# EAGLE design Flipdot (EAGLE 6.4)
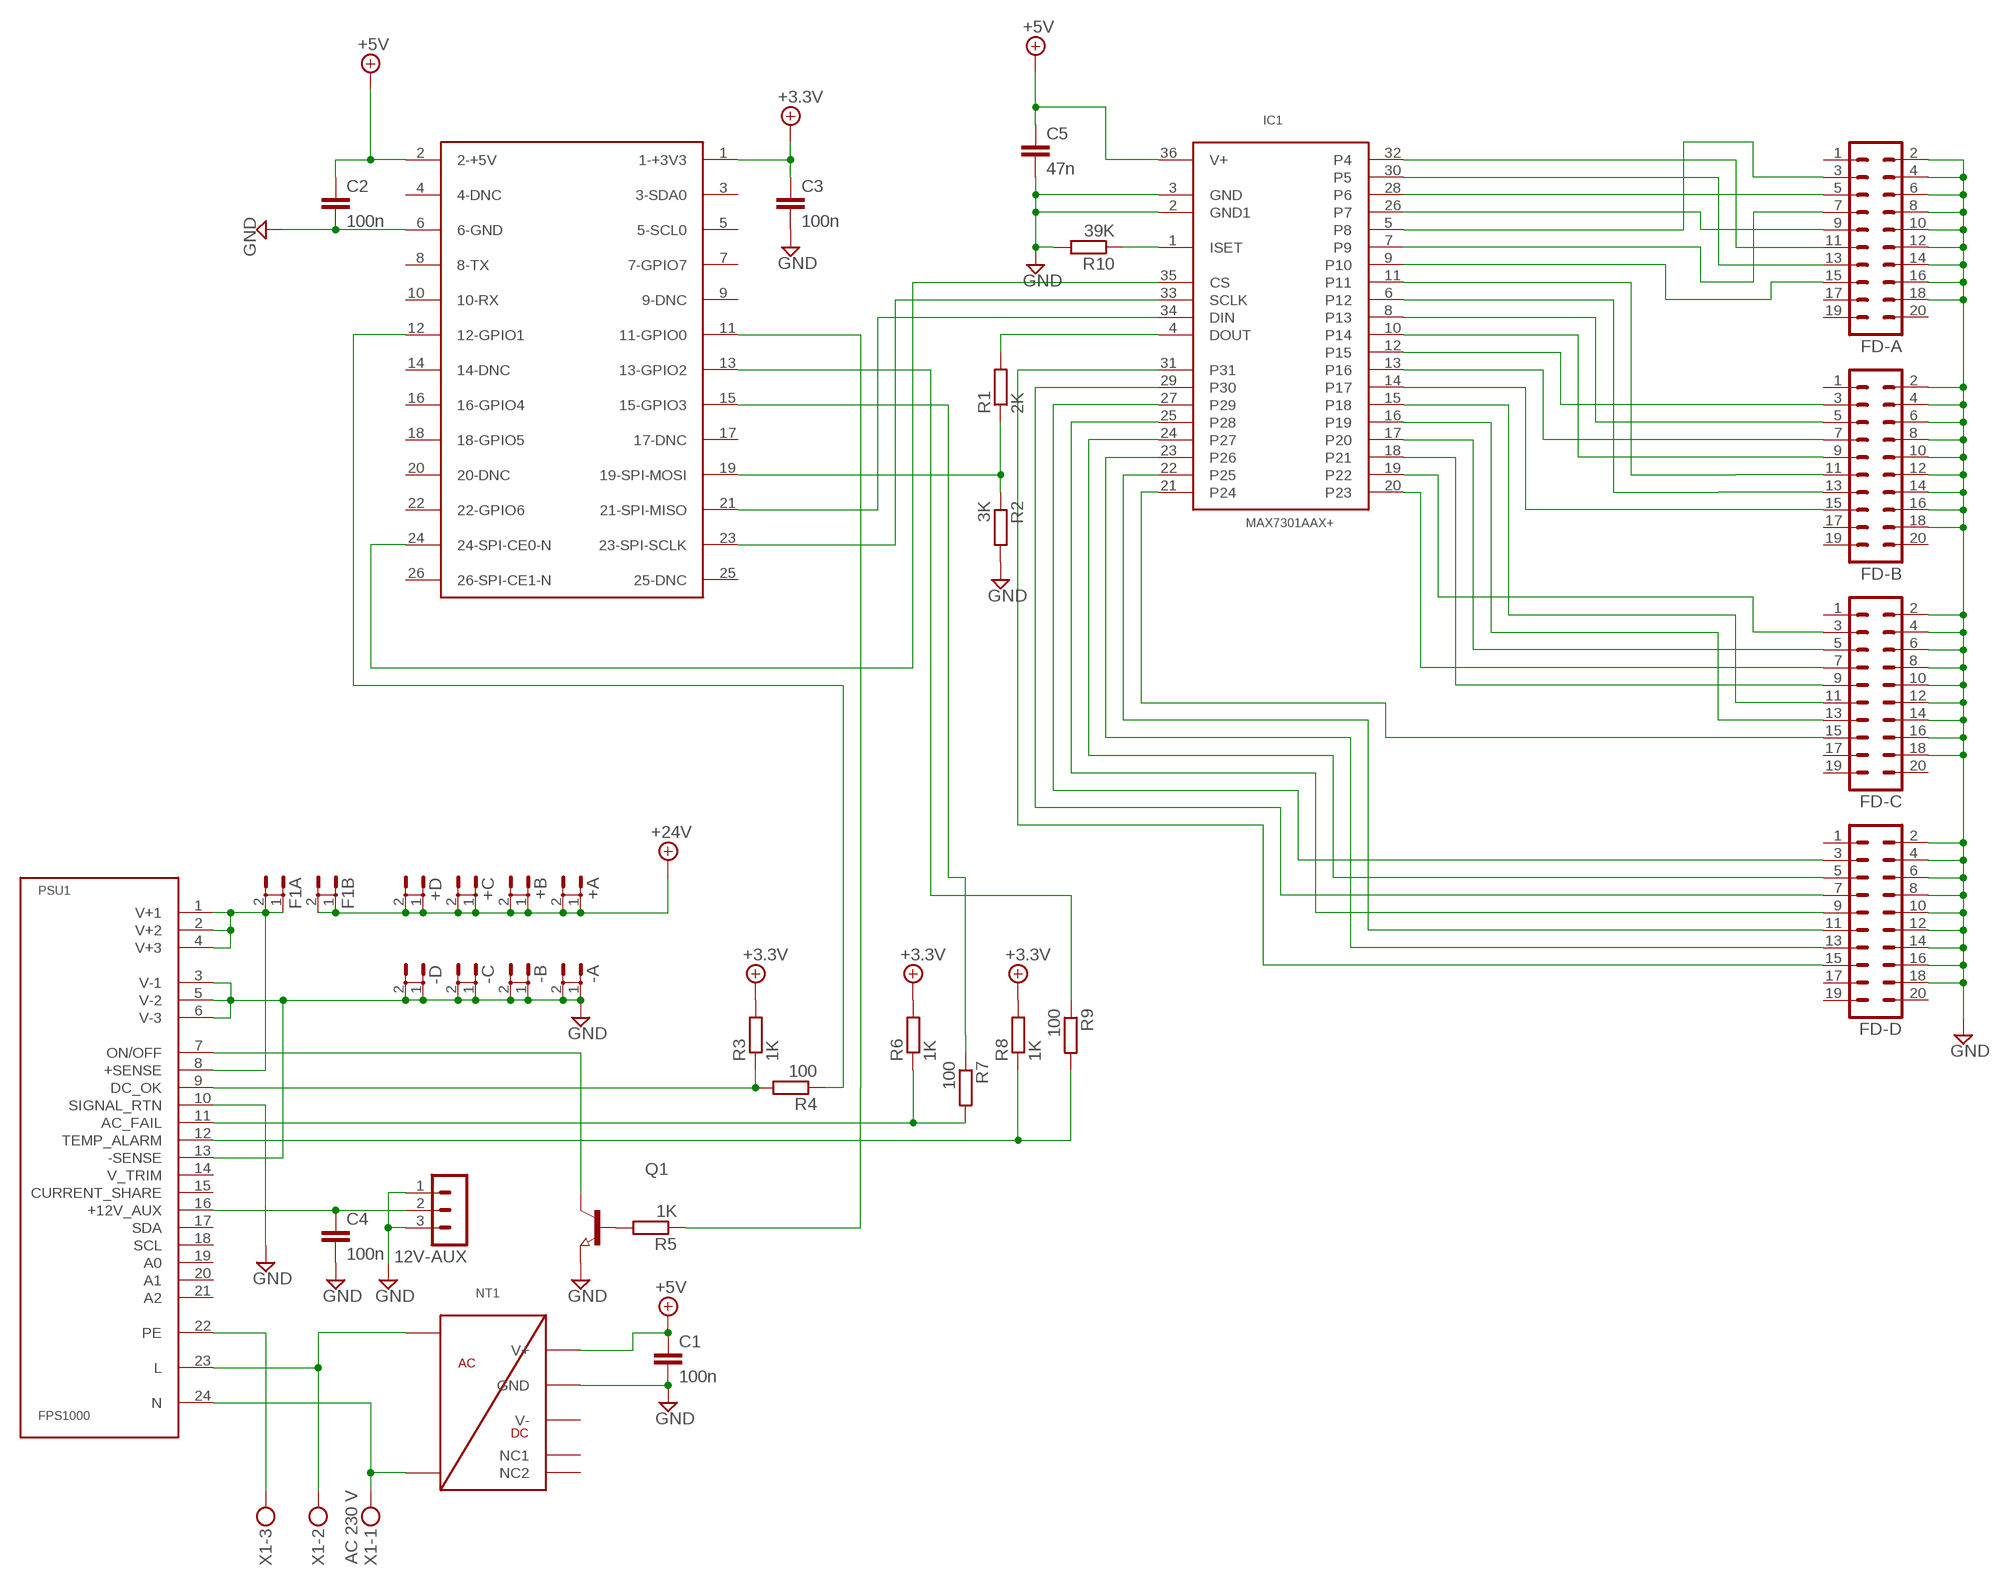
[diagram p0: schematic, sheet 1]

## Parts
12V-AUX  MA03-1  [MA03-1]
+A  ST6,3  [ST6,3]
+B  ST6,3  [ST6,3]
+C  ST6,3  [ST6,3]
+D  ST6,3  [ST6,3]
-A  ST6,3  [ST6,3]
-B  ST6,3  [ST6,3]
-C  ST6,3  [ST6,3]
-D  ST6,3  [ST6,3]
C1  100n  C-EUC0603  [C0603]
C2  100n  C-EUC0603  [C0603]
C3  100n  C-EUC0603  [C0603]
C4  100n  C-EUC0603  [C0603]
C5  47n  C-EUC0603  [C0603]
F1A  ST6,3  [ST6,3]
F1B  ST6,3  [ST6,3]
FD-A  MA10-2  [MA10-2]
FD-B  MA10-2  [MA10-2]
FD-C  MA10-2  [MA10-2]
FD-D  MA10-2  [MA10-2]
IC1  MAX7301AAX+  [SSOP36]
NT1  TMPM04  [TPM04]
PSU1  FPS1000  [24W9F]
Q1  NPN-TRANSISTOR_SOT23  [SOT23]
R1  2K  R-EU_R0603  [R0603]
R2  3K  R-EU_R0603  [R0603]
R3  1K  R-EU_R0603  [R0603]
R4  100  R-EU_R0603  [R0603]
R5  1K  R-EU_R0603  [R0603]
R6  1K  R-EU_R0603  [R0603]
R7  100  R-EU_R0603  [R0603]
R8  1K  R-EU_R0603  [R0603]
R9  100  R-EU_R0603  [R0603]
R10  39K  R-EU_R0603  [R0603]
U$1  RASPBERRY-PI  [RASPBERRY-PI]
X1  AC 230 V  MKDSN1,5/3-5,08  [MKDSN1,5/3-5,08]

## Nets
+3.3V: C3.1 R3.2 R6.2 R8.2 U$1.1(1-+3V3)
+5V: C1.1 C2.1 C5.1 IC1.36(V+) NT1.3(V+) U$1.2(2-+5V)
+24V: +A.1 +A.2 +B.1 +B.2 +C.1 +C.2 +D.1 +D.2 F1B.1 F1B.2
GND: 12V-AUX.1 12V-AUX.3 -A.1 -A.2 -B.1 -B.2 -C.1 -C.2 -D.1 -D.2 C1.2 C2.2 C3.2 C4.2 C5.2 FD-A.2 FD-A.4 FD-A.6 FD-A.8 FD-A.10 FD-A.12 FD-A.14 FD-A.16 FD-A.18 FD-B.2 FD-B.4 FD-B.6 FD-B.8 FD-B.10 FD-B.12 FD-B.14 FD-B.16 FD-B.18 FD-C.2 FD-C.4 FD-C.6 FD-C.8 FD-C.10 FD-C.12 FD-C.14 FD-C.16 FD-C.18 FD-D.2 FD-D.4 FD-D.6 FD-D.8 FD-D.10 FD-D.12 FD-D.14 FD-D.16 FD-D.18 IC1.2(GND1) IC1.3(GND) NT1.4(GND) PSU1.3(V-1) PSU1.5(V-2) PSU1.6(V-3) PSU1.10(SIGNAL_RTN) PSU1.13(-SENSE) Q1.2(E) R2.2 R10.2 U$1.6(6-GND)
N$1: FD-D.11 IC1.22(P25)
N$2: FD-D.13 IC1.23(P26)
N$3: FD-A.5 IC1.28(P6)
N$4: FD-A.9 IC1.26(P7)
N$5: FD-A.3 IC1.5(P8)
N$6: FD-A.7 IC1.7(P9)
N$7: FD-A.15 IC1.9(P10)
N$8: FD-B.5 IC1.8(P13)
N$9: FD-B.9 IC1.10(P14)
N$10: FD-B.3 IC1.12(P15)
N$11: FD-B.7 IC1.13(P16)
N$12: FD-B.15 IC1.14(P17)
N$13: FD-C.5 IC1.17(P20)
N$14: FD-C.9 IC1.18(P21)
N$15: FD-C.3 IC1.19(P22)
N$16: FD-C.7 IC1.20(P23)
N$17: FD-C.15 IC1.21(P24)
N$18: FD-D.5 IC1.24(P27)
N$19: FD-D.9 IC1.25(P28)
N$20: FD-D.3 IC1.27(P29)
N$21: FD-D.7 IC1.29(P30)
N$22: FD-D.15 IC1.31
N$23: IC1.33(SCLK) U$1.23(23-SPI-SCLK)
N$24: IC1.35(CS) U$1.24(24-SPI-CE0-N)
N$25: IC1.34(DIN) U$1.21(21-SPI-MISO)
N$26: F1A.1 F1A.2 PSU1.1(V+1) PSU1.2(V+2) PSU1.4(V+3) PSU1.8(+SENSE)
N$27: Q1.1(B) R5.2
N$28: PSU1.7(ON/OFF) Q1.3(C)
N$29: PSU1.9(DC_OK) R3.1 R4.2
N$30: R5.1 U$1.11(11-GPIO0)
N$31: R4.1 U$1.12(12-GPIO1)
N$32: PSU1.11(AC_FAIL) R6.1 R7.2
N$33: R9.1 U$1.13(13-GPIO2)
N$34: PSU1.12(TEMP_ALARM) R8.1 R9.2
N$35: R7.1 U$1.15(15-GPIO3)
N$36: PSU1.22(PE) X1.3
N$37: FD-B.13 IC1.6(P12)
N$38: IC1.4(DOUT) R1.2
N$39: R1.1 R2.1 U$1.19(19-SPI-MOSI)
N$40: FD-B.11 IC1.11
N$41: FD-C.11 IC1.15(P18)
N$42: FD-A.11 IC1.32(P4)
N$43: FD-C.13 IC1.16(P19)
N$45: FD-A.13 IC1.30(P5)
N$46: NT1.6(N) PSU1.24(N) X1.1
N$47: NT1.7(L) PSU1.23(L) X1.2
N$48: IC1.1(ISET) R10.1
N$50: 12V-AUX.2 C4.1 PSU1.16(+12V_AUX)
Unconnected: FD-A.1 FD-A.17 FD-A.19 FD-A.20 FD-B.1 FD-B.17 FD-B.19 FD-B.20 FD-C.1 FD-C.17 FD-C.19 FD-C.20 FD-D.1 FD-D.17 FD-D.19 FD-D.20 PSU1.14(V_TRIM) PSU1.15(CURRENT_SHARE) PSU1.17(SDA) PSU1.18(SCL) PSU1.19(A0) PSU1.20(A1) PSU1.21(A2) U$1.3(3-SDA0) U$1.4(4-DNC) U$1.5(5-SCL0) U$1.7(7-GPIO7) U$1.8(8-TX) U$1.9(9-DNC) U$1.10(10-RX) U$1.14(14-DNC) U$1.16(16-GPIO4) U$1.17(17-DNC) U$1.18(18-GPIO5) U$1.20(20-DNC) U$1.22(22-GPIO6) U$1.25(25-DNC) U$1.26(26-SPI-CE1-N)

## Power pins joined to a net without a drawn wire
NC1: NT1.1(NC1)
NC2: NT1.2(NC2)
V-: NT1.5(V-)

## Library data of the parts
12V-AUX = con-lstb:MA03-1: PIN HEADER; OC_FARNELL: unknown; OC_NEWARK: unknown
+A +B +C +D -A -B -C -D F1A F1B = con-rib:ST6,3: RIBBON CABLE CONNECTOR Flachstecker / Faston; OC_FARNELL: unknown; OC_NEWARK: unknown
C1-C5 = rcl:C-EU: CAPACITOR, European symbol
FD-A FD-B FD-C FD-D = con-lstb:MA10-2: PIN HEADER; OC_FARNELL: unknown; OC_NEWARK: unknown
IC1 = maxim:MAX7301AAX+: Maxim 28 Port SPI 28 MHz I/O Expander 2.5 - 5.5 V
NT1 = Ice:TMPM04: Traco Power TMPM 04 Schaltnetzteil 4W
PSU1 = positronic:FPS1000: TDK Lamda FPS1000 with Positronic PCIB24W9F400A1 Connector
Q1 = semicon-smd-ipc:NPN-TRANSISTOR_: NPN TRANSISTOR
R1-R10 = rcl:R-EU_: RESISTOR, European symbol
U$1 = RaspberryPi:RASPBERRY-PI: Raspberry Pi Board <http://www.raspberrypi.org/> Jacques Lagnel V1.0 (beta) 2012 Board dimension: Forum 3D model <http://www.raspberrypi.org/forum/general-discussion/mechanical-profile-3d-models?value=3d%20model&type=1&include=1&search=1&ret=all> The GPIO Connector (P1): http://elinux.org/RPi_Low-level_peripherals
X1 = con-phoenix-508:MKDSN1,5/3-5,08: MKDSN 1,5/ 3-5,08 Printklemme Nennstrom: 13,5 A Nennspannung: 250 V Rastermaß: 5,08 mm Polzahl: 3 Anschlussart: Schraubanschluss Montage: Löten Anschlussrichtung Leiter/Platine: 0 ° Artikelnummer: 1729131 Source: http://eshop.phoenixcontact.com .. 1729131.pdf; MPN: SMKDSN1,5/3-5,08; OC_FARNELL: 1792904; OC_NEWARK: 70R0299

## Board
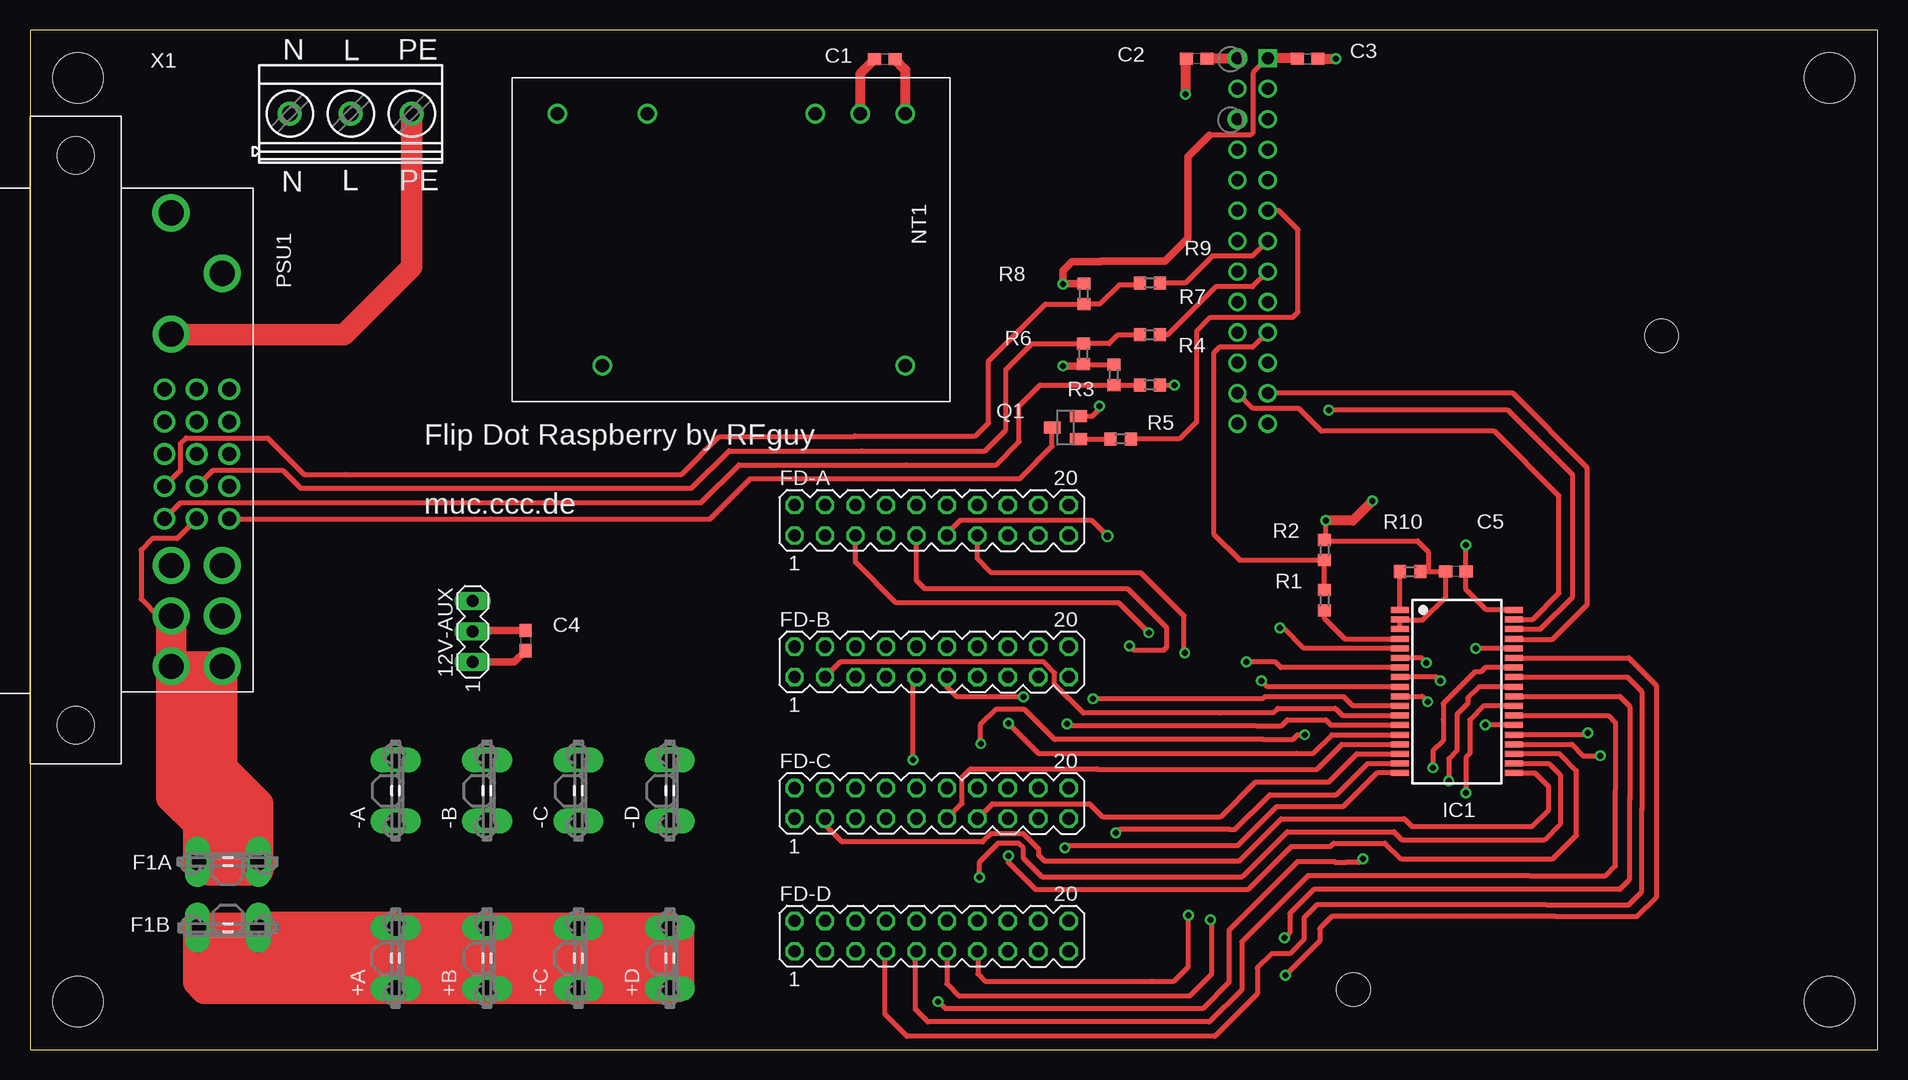
[diagram p1: board, top side]
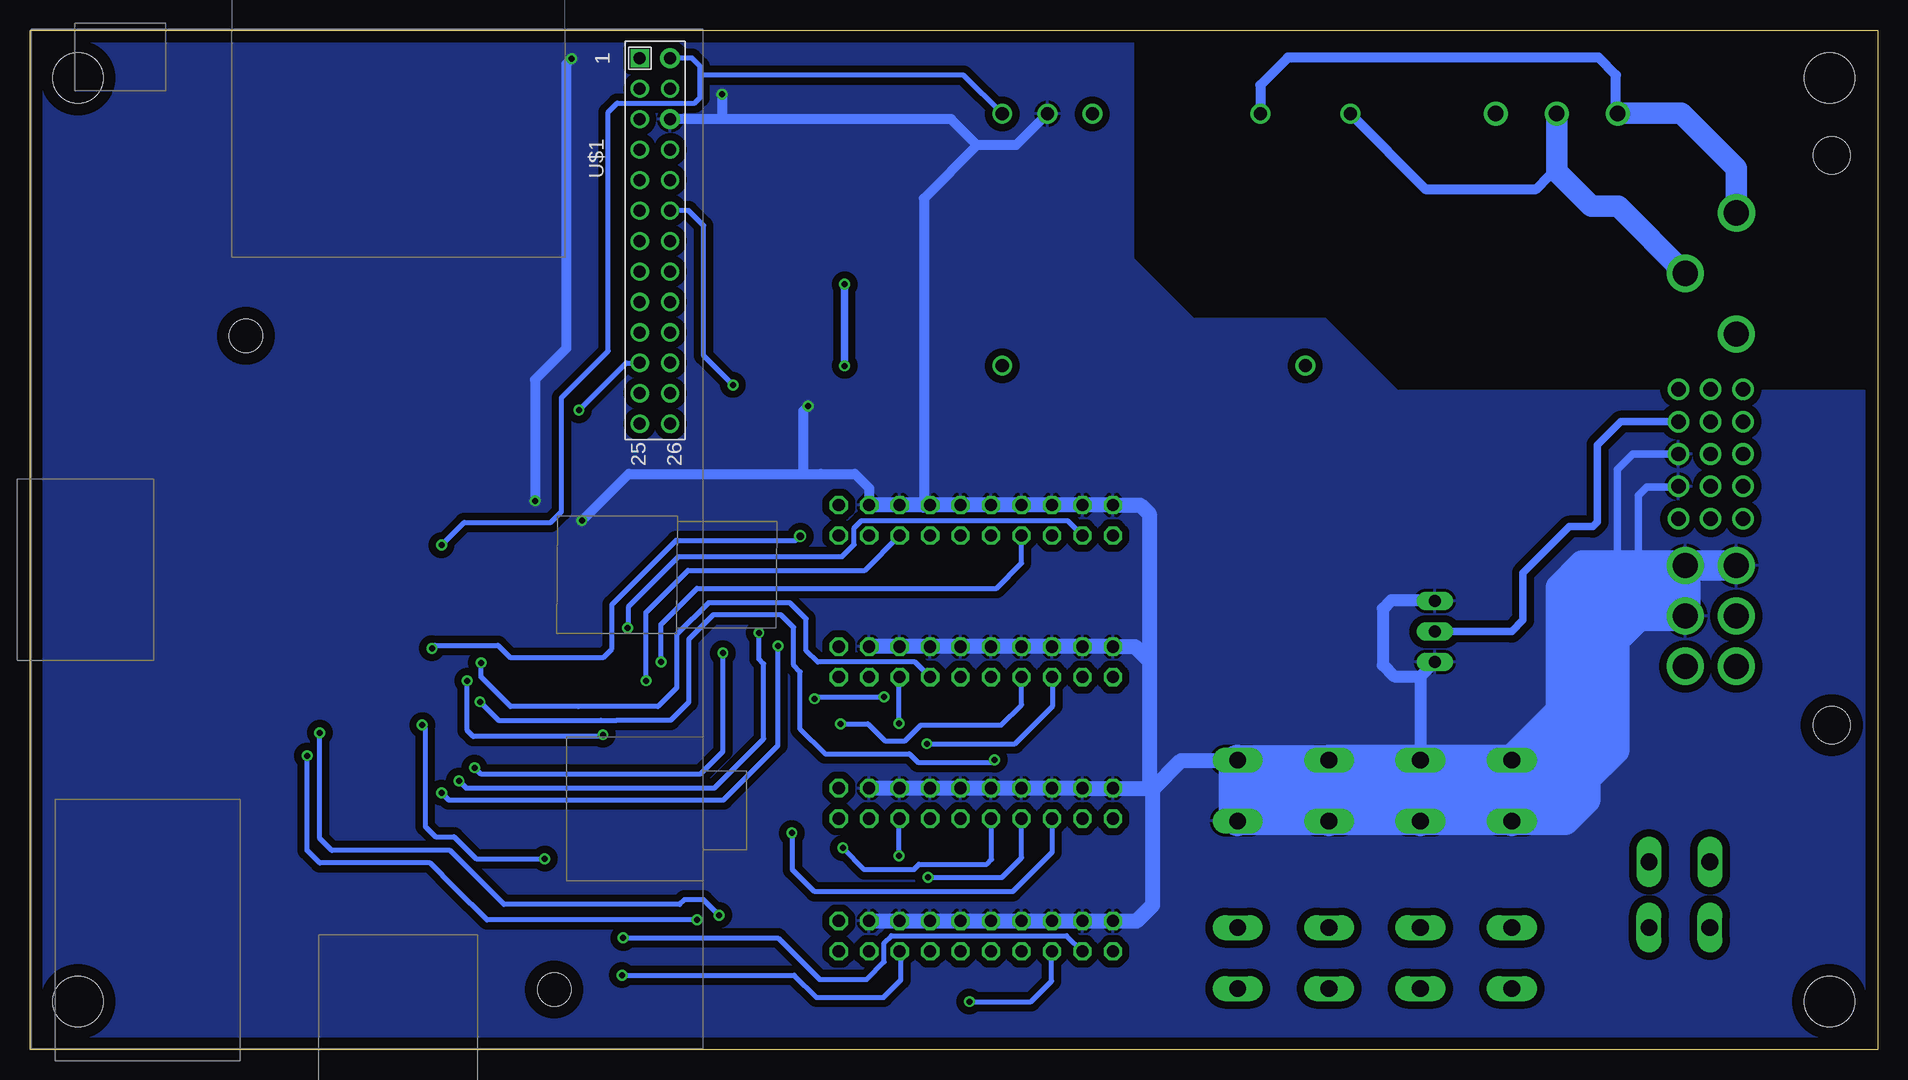
[diagram p2: board, bottom side, seen from below]

Size 154 x 85 mm. Coordinates in mm from the lower left corner, seen from the top.
Outline: 0,0 154,0 154,85 0,85 0,0
Copper layers (1*16): Top 0.035mm / dielectric 1.5mm / Bottom 0.035mm
Design rules "default": minimum track width 10mil, minimum drill 24mil, track to track 8mil, track to pad 8mil, pad to pad 8mil, via to via 8mil, smd to smd 8mil, copper to edge 40mil, drill to drill 8mil, minimum pad ring 10mil, minimum via ring 8mil, stop-mask expansion 4mil, vias tented up to drill 0mil, thermal gap 10mil
Holes 2.8 mm at 110.3,5 136,59.5
Holes 4.2 mm at 4,81 4,4 150,4 150,81

### Footprints (pad centres in the part's own frame; a part is rotated, then mirrored left to right if it is on the bottom)
MA03-1 = drill 1.016 long: 1 -2.54,0; 2 0,0; 3 2.54,0
ST6,3 = drill 1.397 long: 1 -2.54,0; 2 2.54,0
C0603 = smd 1.1 x 1: 1 -0.85,0; 2 0.85,0
MA10-2 = drill 1.016 octagon: 1 -11.43,-1.27; 2 -11.43,1.27; 3 -8.89,-1.27; 4 -8.89,1.27; 5 -6.35,-1.27; 6 -6.35,1.27; 7 -3.81,-1.27; 8 -3.81,1.27; 9 -1.27,-1.27; 10 -1.27,1.27; 11 1.27,-1.27; 12 1.27,1.27; 13 3.81,-1.27; 14 3.81,1.27; 15 6.35,-1.27; 16 6.35,1.27; 17 8.89,-1.27; 18 8.89,1.27; 19 11.43,-1.27; 20 11.43,1.27
SSOP36 = smd 0.5 x 1.5: 1 -6.8,-4.75; 2 -6,-4.75; 3 -5.2,-4.75; 4 -4.4,-4.75; 5 -3.6,-4.75; 6 -2.8,-4.75; 7 -2,-4.75; 8 -1.2,-4.75; 9 -0.4,-4.75; 10 0.4,-4.75; 11 1.2,-4.75; 12 2,-4.75; 13 2.8,-4.75; 14 3.6,-4.75; 15 4.4,-4.75; 16 5.2,-4.75; 17 6,-4.75; 18 6.8,-4.75; 19 6.8,4.75; 20 6,4.75; 21 5.2,4.75; 22 4.4,4.75; 23 3.6,4.75; 24 2.8,4.75; 25 2,4.75; 26 1.2,4.75; 27 0.4,4.75; 28 -0.4,4.75; 29 -1.2,4.75; 30 -2,4.75; 31 -2.8,4.75; 32 -3.6,4.75; 33 -4.4,4.75; 34 -5.2,4.75; 35 -6,4.75; 36 -6.8,4.75
TPM04 = drill 1.1: 1 10.5,-10.75; 2 10.5,14.5; 3 -10.5,14.5; 4 -10.5,10.75; 5 -10.5,7; 6 -10.5,-7; 7 -10.5,-14.5
24W9F = drill 2.1: 1 18.85,12.21; 2 18.85,7.96; 3 14.65,12.21; 4 14.65,7.96; 5 10.45,12.21; 6 10.45,7.96; 22 -8.85,7.96; 23 -13.9,12.21; 24 -18.95,7.95 | drill 1.2: 7 6.55,12.79; 8 6.55,10.09; 9 6.55,7.39; 10 3.85,12.79; 11 3.85,10.09; 12 3.85,7.39; 13 1.15,12.79; 14 1.15,10.09; 15 1.15,7.39; 16 -1.55,12.79; 17 -1.55,10.09; 18 -1.55,7.39; 19 -4.25,12.79; 20 -4.25,10.09; 21 -4.25,7.39 | hole 3.1: -23.75,0; 23.75,0
SOT23 = smd 1 x 1.4: 1 -0.95,-1.1; 2 0.95,-1.1; 3 0,1.1
R0603 = smd 1 x 1.1: 1 -0.85,0; 2 0.85,0
RASPBERRY-PI = drill 1 square: 1 0,0 | drill 1 pad 1.676: 2 0,2.54; 6 5.08,2.54 | drill 1: 3 2.54,0; 4 2.54,2.54; 5 5.08,0; 7 7.62,0; 8 7.62,2.54; 9 10.16,0; 10 10.16,2.54; 11 12.7,0; 12 12.7,2.54; 13 15.24,0; 14 15.24,2.54; 15 17.78,0; 16 17.78,2.54; 17 20.32,0; 18 20.32,2.54; 19 22.86,0; 20 22.86,2.54; 21 25.4,0; 22 25.4,2.54; 23 27.94,0; 24 27.94,2.54; 25 30.48,0; 26 30.48,2.54
MKDSN1,5/3-5,08 = drill 1.3 pad 2: 1 -7.641,0.025; 2 -2.561,0.025; 3 2.519,0.025

### Placement (x,y rotation side)
12V-AUX  36.9,34.85 90 top
+A  30.48,7.62 90 top
+B  38.1,7.62 90 top
+C  45.72,7.62 90 top
+D  53.34,7.62 90 top
-A  30.48,21.59 90 top
-B  38.1,21.59 90 top
-C  45.72,21.59 90 top
-D  53.34,21.59 90 top
C1  71.25,82.55 180 top
C2  97.25,82.6 180 top
C3  106.5,82.6 0 top
C4  41.3,34.1 270 top
C5  118.85,39.85 180 top
F1A  16.51,15.65 180 top
F1B  16.51,10.16 0 top
FD-A  75.16,44.12 0 top
FD-B  75.16,32.32 0 top
FD-C  75.16,20.52 0 top
FD-D  75.16,9.45 0 top
IC1  118.94,29.85 270 top
NT1  58.45,67.51 270 top
PSU1  3.81,50.8 270 top
Q1  86.3,51.85 90 top
R1  107.9,37.45 270 top
R2  107.9,41.65 90 top
R3  90.35,56.25 90 top
R4  93.35,55.4 180 top
R5  90.9,50.9 180 top
R6  87.8,58 270 top
R7  93.35,59.6 180 top
R8  87.85,63 90 top
R9  93.35,63.9 180 top
R10  115.05,39.85 0 top
U$1  103.17,82.65 270 bottom
X1  29.3,78 0 top

### Tracks (layer width: path | path; a pad name or v marks a point on that pad's centre or on a via)
+3.3V  (via drill 0.5)
  Top 0.406: R6.2 87.85,57.1 R3.2 | U$1.1 101.95,81.43 101.95,76.45 101.75,76.25 98.3,76.25
  Top 0.61: R6.2 87.65,57 v86.1,57 | R8.2 86.15,63.85 v86.1,63.8 86.1,64.95 86.85,65.7 89.25,65.7 89.3,65.75 94.6,65.75 96.5,67.65 96.5,74.45 98.3,76.25
  Top 0.813: C3.1 105.6,82.65 U$1.1
  Bottom 0.61: v86.1,57 v86.1,63.8
+5V  (via drill 0.5)
  Top 0.406: IC1.36 121.4,36.65 119.7,38.35 C5.1 v119.7,42.05
  Top 0.813: C1.1 72.95,81.7 NT1.3 | C2.1 98.15,82.65 U$1.2
  Bottom 0.406: v119.7,42.05 117.8,43.95 110.6,43.95 109.7,44.85 109.7,54.35 105.8,58.25 105.8,78.15 105.05,78.9 98.6,78.9 98.15,79.35 98.15,81.25 | 98.15,81.25 98.15,82 98.8,82.65 U$1.2 | NT1.3 76.19,81.25 98.15,81.25
+24V
  Top 0.406: 53.55,5.25 53.38,5.08 +D.1
  Top 2.54: +D.2 +C.2 +B.2 +A.2 30.39,10.25 19.6,10.25 19.51,10.16 F1B.2 F1B.1 14,10.13 14,5.65 14.57,5.08 +A.1 37.55,5.08 +B.1 45.2,5.08 +C.1 +D.1 | 15.8,8.9 15.8,8.35 54.05,8.35 54.05,9.9 54.1,9.9 54.1,5.25 53.55,5.25 53.55,6.55 15.45,6.55 15.45,6.7
GND  (via drill 0.5)
  Top 0.406: IC1.3 IC1.2 114.24,35.8 116.05,35.8 118,37.75 C5.2 116.55,39.85 | R10.2 116.55,39.85 | 116.55,39.85 116.55,41.5 115.65,42.4 108,42.4 R2.2 108,42.6 v108,44.1 | Q1.2 88.55,52.8 89.15,53.4 v89.15,53.65
  Top 0.61: C4.2 40.36,32.31 12V-AUX.1
  Top 0.813: C1.2 69.2,81.35 NT1.4 | C2.2 96.3,82.5 v96.3,79.65 | C3.2 v108.85,82.6 | v111.9,45.75 110.25,44.1 v108,44.1
  Bottom 0.61: PSU1.10 16.65,46.9 19.25,46.9 19.95,46.2 19.95,40.35 | PSU1.13 20.4,49.65 21.7,48.35 21.7,40.35
  Bottom 0.813: v108,44.1 104.1,48 89.55,48 | 89.55,48 88.1,48 85.25,48 84.05,46.8 FD-A.18 | NT1.4 71.81,75.4 75.05,75.4 | 75.05,75.4 77.22,77.57 96.3,77.57 | 96.3,77.57 U$1.6 | 75.05,75.4 79.5,70.95 79.5,45.39 | v89.15,53.65 89.55,53.25 89.55,48 | v96.3,79.65 96.3,77.57 | v108.85,82.6 109.3,82.15 109.3,58.45 111.9,55.85 v111.9,45.75
  Bottom 1.016: 12V-AUX.1 38.1,31.11 | 38.1,31.11 -B.2 | 12V-AUX.3 36.96,37.45 40.55,37.45 41.25,36.75 41.25,32.05 40.31,31.11 38.1,31.11
  Bottom 1.27: FD-D.18 FD-D.16 FD-D.14 FD-D.12 FD-D.10 FD-D.8 FD-D.6 FD-D.4 FD-D.2 61.73,10.72 60.4,12.05 60.4,21.6 | 60.4,21.6 60.4,21.75 58.05,24.1 53.37,24.1 -D.2 | 60.75,21.79 FD-C.2 FD-C.4 FD-C.6 FD-C.8 FD-C.10 FD-C.12 FD-C.14 FD-C.16 FD-C.18 | 60.75,21.79 60.59,21.79 60.4,21.6 | 60.7,32.4 61.89,33.59 FD-B.2 FD-B.4 FD-B.6 FD-B.8 FD-B.10 FD-B.12 FD-B.14 FD-B.16 FD-B.18 | 60.7,32.4 60.7,21.84 60.75,21.79 | 60.7,32.4 60.7,44.65 60.75,44.7 61.44,45.39 FD-A.2 FD-A.4 FD-A.6 FD-A.8 FD-A.10 FD-A.12 FD-A.14 79.5,45.39 FD-A.16 FD-A.18
  Bottom 2.54: -D.2 53.31,24.1 45.2,24.1 45.23,24.13 -C.2 -B.2 -A.2 26.4,28.21 26.4,38.5 24.55,40.35 21.7,40.35 19.95,40.35 PSU1.5 | -A.1 30.38,19.15 30,19.15 | 30,19.15 26.05,19.15 24.35,20.85 24.35,22.6 21.95,25 21.95,34.15 19.95,36.15 PSU1.3 PSU1.5 | -B.1 38,19.15 37.6,19.15 | 37.6,19.15 30,19.15 | -C.1 45.62,19.15 45,19.15 | 45,19.15 37.6,19.15 | -D.1 53.24,19.15 45,19.15 | PSU1.6 PSU1.5 | 17.05,38.55 23.7,38.55 24.9,37.35 24.9,26.45 28.9,22.45 52.85,22.45 52.85,23.15 53.65,23.95 53.65,19.4 53.6,19.35 53.6,19.4 52.4,20.6 27.5,20.6 26.9,21.2 26.9,21.35 25.35,22.9 25.35,23.75 23.5,25.6 23.5,36.45 22.95,37 21.75,37 21.45,37.3 21.45,36.8 22.5,35.75
  pour Bottom (isolate 0.61): 0,55 40,55 46,61 57,61 62,66 62,84 153,84 153,0 0,0
N$1  (via drill 0.5)
  Top 0.406: FD-D.11 76.43,5.47 77.4,4.5 96.7,4.5 98.5,6.3 98.5,10.7 v98.4,10.8 | IC1.22 128.5,25.45 129.45,24.5 v130.9,24.5
  Bottom 0.406: v98.4,10.8 115.9,10.8 118.55,13.45 120.65,15.55 129.85,15.55 130.9,16.6 v130.9,24.5
N$2  (via drill 0.5)
  Top 0.406: FD-D.13 79,8.15 79,6.3 79.6,5.7 93.5,5.7 95.35,5.7 96.55,6.9 v96.55,11.2 | v129.85,26.4 129.7,26.25 IC1.23
  Bottom 0.406: v96.55,11.2 97.85,12.5 99.45,12.5 99.85,12.1 114.5,12.1 119,16.6 128.85,16.6 129.85,17.6 v129.85,26.4
N$3  (via drill 0.5)
  Top 0.406: IC1.28 120.8,30.25 119.85,29.3 119.85,28.85 118.95,27.95 118.95,24.95 118.25,24.25 v118.25,22.4 | v93.25,34.75 90.75,37.25 72.2,37.25 68.81,40.64 FD-A.5
  Bottom 0.406: v118.25,22.4 117.65,21.8 105.75,21.8 96.95,21.8 92.85,25.9 92.85,32.15 93.25,32.55 v93.25,34.75
N$4  (via drill 0.5)
  Top 0.406: IC1.26 121.15,28.65 120,27.5 120,24.65 119.7,24.35 v119.7,21.4 | v91.65,33.65 92,33.3 94.5,33.3 94.75,33.55 94.75,35.15 91.5,38.4 74.6,38.4 73.89,39.11 FD-A.9
  Bottom 0.406: v119.7,21.4 119.1,20.8 96.2,20.8 91.65,25.35 v91.65,33.65
N$5  (via drill 0.5)
  Top 0.406: IC1.5 106.2,33.45 104.5,35.15 v104.2,35.15
  Bottom 0.406: v104.2,35.15 104.1,35.25 104.1,36.95 99.95,41.1 86.3,41.1 85.3,42.1 85.3,43.5 84.7,44.1 67.52,44.1 FD-A.3
N$6  (via drill 0.5)
  Top 0.406: IC1.7 104.25,31.85 103.8,32.3 v101.4,32.3
  Bottom 0.406: v101.4,32.3 101.4,35.45 98.4,38.45 73.45,38.45 71.35,40.55 FD-A.7
N$7  (via drill 0.5)
  Top 0.406: IC1.9 103.15,30.25 v102.65,30.75
  Bottom 0.406: v102.65,30.75 102.65,36.45 99.15,39.95 84.41,39.95 FD-A.15
N$8  (via drill 0.5)
  Top 0.406: v79.25,25.5 79.2,25.55 79.2,27.05 80.5,28.35 82.9,28.35 85.4,25.85 102.85,25.85 105.25,25.85 105.65,26.25 v106.25,26.25 | v117.55,30.75 117.25,31.05 IC1.8
  Bottom 0.406: v79.25,25.5 71.9,25.5 68.75,28.65 68.75,30.99 FD-B.5 | v106.25,26.25 106.4,26.1 117.05,26.1 117.55,26.6 v117.55,30.75
N$9  (via drill 0.5)
  Top 0.406: v73.6,24.15 73.6,30.76 FD-B.9 | IC1.10 116.05,29.45 v116.5,29
  Bottom 0.406: v73.6,24.15 73.8,23.95 80,23.95 80.7,24.65 87.75,24.65 89.8,26.7 89.8,31.5 90.35,32.05 90.35,35.2 91.4,36.25 97.05,36.25 99.1,34.2 99.1,28.95 100.6,27.45 105.1,27.45 106.4,27.45 114.95,27.45 v116.5,29
N$10
  Top 0.406: IC1.12 109.4,27.85 108.8,28.45 104,28.45 103.65,28.1 99.25,28.1 99.2,28.05 87.8,28.05 85.4,30.45 85.4,31.4 84.5,32.3 67.52,32.3 FD-B.3
N$11  (via drill 0.5)
  Top 0.406: v86.45,27.15 86.6,27 102.2,27 104.3,27 104.8,27.5 108,27.5 108.45,27.05 IC1.13
  Bottom 0.406: v86.45,27.15 84.15,27.15 82.75,25.75 81.05,25.75 79.75,27.05 73.05,27.05 71.35,28.75 FD-B.7
N$12  (via drill 0.5)
  Top 0.406: v81.55,27.2 84.05,24.7 105.6,24.7 106.95,24.7 108.5,26.25 IC1.14
  Bottom 0.406: v81.55,27.2 81.55,31.01 FD-B.15
N$13  (via drill 0.5)
  Top 0.406: v90.5,18.05 90.8,18.35 100,18.35 100.45,18.35 103.35,21.25 108.9,21.25 111.5,23.85 IC1.17
  Bottom 0.406: FD-C.5 68.81,16.44 72.1,13.15 88.6,13.15 90.45,15 90.45,18 v90.5,18.05
N$14  (via drill 0.5)
  Top 0.406: v86.25,16.8 86.45,17 100.35,17 100.65,17 103.9,20.25 104.15,20.25 109.45,20.25 112.25,23.05 IC1.18
  Bottom 0.406: FD-C.9 73.85,19.21 73.85,15.85 74.25,15.45 79.9,15.45 80.35,15 84.45,15 v86.25,16.8
N$15
  Top 0.406: IC1.19 125.45,23.05 126.6,21.9 126.6,20 125.2,18.6 115.2,18.6 114.55,19.25 104.3,19.25 100.75,15.7 84.6,15.7 84.1,16.2 84.1,16.7 82.8,18 80.1,18 79.4,17.3 67.7,17.3 66.27,18.73 FD-C.3
N$16  (via drill 0.5)
  Top 0.406: v79.15,14.35 79.15,15.65 80.7,17.2 82.4,17.2 82.8,16.8 82.8,15.95 84.35,14.4 101.05,14.4 104.8,18.15 113.7,18.15 114.35,17.5 126.25,17.5 127.55,18.8 127.55,22.9 126.6,23.85 IC1.20
  Bottom 0.406: v79.15,14.35 73,14.35 71.35,16 FD-C.7
N$17  (via drill 0.5)
  Top 0.406: v81.55,16.15 81.55,15.6 83.8,13.35 101.55,13.35 102.35,14.15 105.1,16.9 108.35,16.9 108.65,17.2 112.95,17.2 114.25,15.9 126.95,15.9 128.9,17.85 128.9,23.25 127.5,24.65 IC1.21
  Bottom 0.406: v81.55,16.15 81.55,19.21 FD-C.15
N$18  (via drill 0.5)
  Top 0.406: v75.7,4 76.3,3.4 97.75,3.4 99.95,5.6 99.95,9.95 105.65,15.65 108.75,15.65 108.8,15.6 109.65,15.6 110.8,15.6 v111.1,15.9 | IC1.24 v121.3,27.05
  Bottom 0.406: v75.7,4 70.55,4 68.85,5.7 68.85,8.14 FD-D.5 | v121.3,27.05 121.05,26.8 121.05,18.6 120.2,17.75 118.65,17.75 116.8,15.9 v111.1,15.9
N$19
  Top 0.406: 73.85,8.14 FD-D.9 73.8,8.09 73.8,3.35 74.85,2.3 98.3,2.3 101,5 101,9 106.5,14.5 125,14.5 131.35,14.5 132.15,15.3 132.15,21.65 132.15,27.25 131.55,27.85 IC1.25
N$20  (via drill 0.5)
  Top 0.406: v104.55,9.3 105,9.75 105,11.35 107,13.35 132.5,13.35 133.35,14.2 133.35,20.85 133.35,21.05 133.35,28.6 132.5,29.45 IC1.27
  Bottom 0.406: v104.55,9.3 91.65,9.3 88.2,5.85 84.25,5.85 82.8,7.3 82.8,8.9 82.2,9.5 67.59,9.5 FD-D.3
N$21
  Top 0.406: FD-D.7 71.25,8.08 71.25,2.95 73.1,1.1 98.75,1.1 102.3,4.65 102.3,6.8 103.5,8 105,8 106.2,9.2 106.2,11 107.25,12.05 126.4,12.05 133.25,12.05 133.9,12.7 134.35,13.15 134.35,20 134.35,29.85 133.15,31.05 IC1.29
N$22  (via drill 0.5)
  Top 0.406: v104.65,6.2 107.5,9.05 107.5,10.1 108.5,11.1 127.2,11.1 133.95,11.1 135.6,12.75 135.6,30.3 135.18,30.73 | IC1.31 133.25,32.65 135.18,30.73 | 135.18,30.73 135.25,30.65
  Bottom 0.406: v104.65,6.2 90.3,6.2 88.45,4.35 82.85,4.35 81.4,5.8 81.4,8.07 FD-D.15
N$23
  Top 0.406: IC1.33 123.74,34.2 126.9,34.2 129.8,37.1 129.8,42.05 129.8,48.5 123.59,54.71 U$1.23
N$24
  Top 0.406: IC1.35 125.25,35.85 127.45,38.05 127.45,46.15 122.05,51.55 107.65,51.55 105.75,53.45 101.95,53.45 100.69,54.71 U$1.24
N$25  (via drill 0.5)
  Top 0.406: IC1.34 125.9,35.05 128.6,37.75 128.6,47.9 123.2,53.3 v108.25,53.3
  Bottom 0.406: v108.25,53.3 104.3,57.25 U$1.21
N$26
  Top 0.406: PSU1.8 12.25,42.6 10.2,42.6 9.25,41.65 9.25,37.55 10.65,36.15 PSU1.4 | F1A.1 19,15.6 19,15.5
  Top 2.54: PSU1.4 PSU1.2 | PSU1.2 PSU1.1 16.02,23.48 19,20.5 19,15.7 F1A.1 | PSU1.2 11.77,21.03 14,18.8 14,15.68 F1A.2 | 18.95,17.75 19,17.75 19,15.5 19,14.95 14.95,14.95 14.95,15.15 15.6,15.15 15.6,19.6 13.45,21.75 13.45,30.1 13.5,30.15 14.05,30.15 14.15,30.25 14.15,23.2 15.25,22.1 15.25,21.75 17.5,19.5 17.5,16.2 17.4,16.1
N$27
  Top 0.406: Q1.1 R5.2
N$28
  Top 0.406: PSU1.7 38.4,44.25 56.7,44.25 60.05,47.6 73.35,47.6 82.5,47.6 85.2,50.3 Q1.3
N$29
  Top 0.406: PSU1.9 12.55,45.6 19,45.6 55.95,45.6 59.1,48.75 73.05,48.75 80.55,48.75 82.45,50.65 82.45,53.65 84.2,55.4 R3.1 R4.2
N$30
  Top 0.406: R5.1 91.8,50.95 95.85,50.95 97.25,52.35 97.25,59.9 98.4,61.05 105.25,61.05 105.7,61.5 105.7,68.35 104.1,69.95 U$1.11
N$31  (via drill 0.5)
  Top 0.406: R4.1 v95.4,55.4
  Bottom 0.406: v95.4,55.4 97.85,57.85 97.85,68.7 99.1,69.95 U$1.12
N$32
  Top 0.406: PSU1.11 15.25,48.3 21.05,48.3 22.55,46.8 37.7,46.8 55.15,46.8 58.25,49.9 69.35,49.9 79.6,49.9 81.35,51.65 81.35,56.7 83.5,58.85 R6.1 89.95,58.85 90.65,59.55 92.45,59.55 R7.2
N$33
  Top 0.406: U$1.13 101.91,66.15 98.55,66.15 96.3,63.9 R9.1
N$34
  Top 0.406: PSU1.12 12.55,48.3 12.55,50.55 13,51 19.8,51 22.85,47.95 26.35,47.95 54.3,47.95 57.45,51.1 68.7,51.1 68.75,51.15 78.8,51.15 79.9,52.25 79.9,57.4 84.65,62.15 R8.1 89.2,62.15 90.8,63.75 92.35,63.75 R9.2
N$35
  Top 0.406: U$1.15 101.9,63.6 98.85,63.6 94.85,59.6 R7.1
N$36
  Top 1.778: PSU1.22 11.82,59.6 26.2,59.6 31.82,65.22 X1.3
N$37  (via drill 0.5)
  Top 0.406: v116.4,32.25 116,32.65 IC1.6
  Bottom 0.406: FD-B.13 80.22,32.3 88.35,32.3 89.3,33.25 89.3,35.9 90.65,37.25 97.45,37.25 100.1,34.6 100.1,30.15 101.65,28.6 108.3,28.6 113.95,28.6 116.4,31.05 v116.4,32.25
N$38
  Top 0.406: IC1.4 114.14,34.2 109.65,34.2 107.9,35.95 R1.2
N$39
  Top 0.406: R1.1 R2.1 100.85,40.8 98.65,43 98.65,48.9 98.65,58.05 99.15,58.55 101.93,58.55 U$1.19
N$40  (via drill 0.5)
  Top 0.406: IC1.11 110.25,28.65 109.5,29.4 102.9,29.4 102.75,29.25 v88.6,29.25 | v82.8,29.4 77.25,29.4 76.43,30.22 FD-B.11
  Bottom 0.406: v88.6,29.25 88.45,29.4 v82.8,29.4
N$41
  Top 0.406: FD-C.11 77.7,20.52 77.7,22.7 78.4,23.4 88.95,23.4 89,23.35 102.1,23.35 | 101.65,23.35 102.1,23.35 | 102.1,23.35 107.25,23.35 109.35,25.45 IC1.15
N$42  (via drill 0.5, 0.6)
  Top 0.406: IC1.32 v120.5,33.45 | v89.8,42.8 88.5,44.1 77.5,44.1 76.43,43.03 FD-A.11
  Bottom 0.406: v120.5,33.45 120.25,33.7 115,33.7 114,32.7 106.2,32.7 105.5,33.4 105.5,37.1 100.15,42.45 90.15,42.45 v89.8,42.8
N$43
  Top 0.406: FD-C.13 80.22,20.5 88.3,20.5 89.4,19.4 99.25,19.4 102.15,22.3 107.75,22.3 108.25,22.3 110.6,24.65 IC1.16
N$45  (via drill 0.5)
  Top 0.406: IC1.30 121.3,31.85 120.95,31.5 120.45,31.5 117.8,28.85 117.8,27.5 117.8,25.75 116.95,24.9 v116.95,23.5 | v96.25,33.05 96.2,33.1 96.2,36.15 92.6,39.75 80.15,39.75 78.97,40.93 FD-A.13
  Bottom 0.406: v116.95,23.5 116.45,23 98.1,23 96.25,24.85 v96.25,33.05
N$46
  Bottom 0.813: X1.1 21.8,78.17 21.8,81.25 23.25,82.7 46.4,82.7 49.15,82.7 51.45,80.4 NT1.6
  Bottom 1.778: X1.1 21.63,78.05 16.35,78.05 11.76,73.46 PSU1.24
N$47
  Bottom 0.813: NT1.7 37.69,71.75 28.45,71.75 27.4,72.8 26.35,72.8
  Bottom 1.778: PSU1.23 21.62,70.3 23.85,70.3 26.35,72.8 26.74,73.19 X1.2
N$48
  Top 0.406: IC1.1 R10.1
N$50
  Top 0.61: 12V-AUX.2 37,34.95 C4.1
  Bottom 0.61: PSU1.16 21.4,52.35 23.35,50.4 23.35,44 23.75,43.6 25.7,43.6 29.55,39.75 29.55,35.8 30.5,34.85 12V-AUX.2

### Text on the board
tNames: N | L | PE | N | L | PE | Flip Dot Raspberry by RFguy | muc.ccc.de